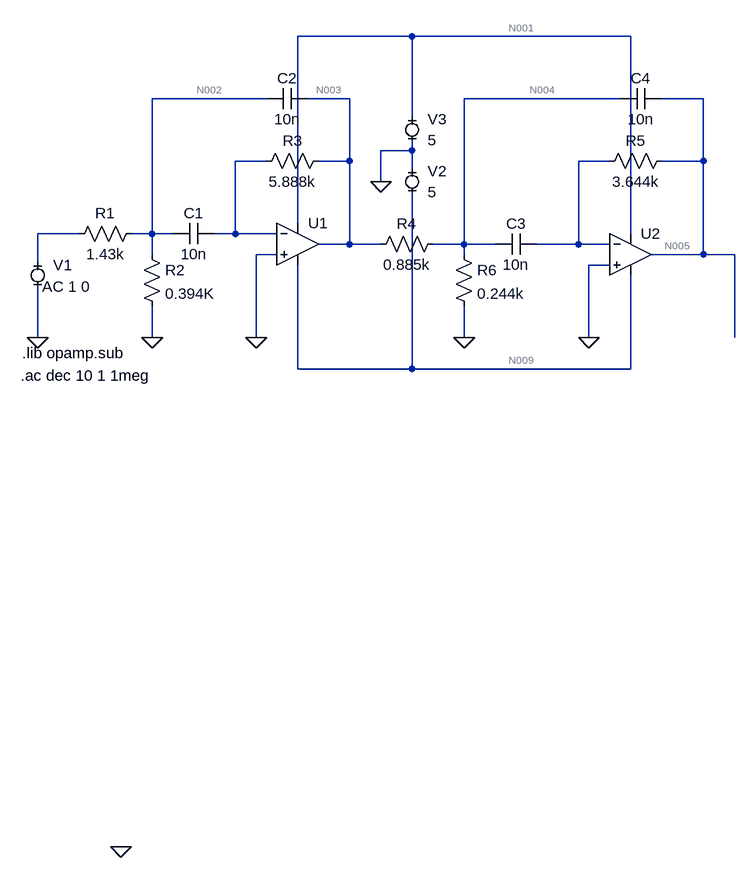
[diagram p0: schematic Draft6.asc]
Draft6.asc, the LTspice schematic file:
Version 4
SHEET 1 964 680
WIRE 448 -1248 272 -1248
WIRE 784 -1248 448 -1248
WIRE 224 -1152 48 -1152
WIRE 352 -1152 288 -1152
WIRE 768 -1152 528 -1152
WIRE 896 -1152 832 -1152
WIRE 448 -1120 448 -1248
WIRE 448 -1072 448 -1088
WIRE 448 -1072 400 -1072
WIRE 224 -1056 176 -1056
WIRE 352 -1056 352 -1152
WIRE 352 -1056 304 -1056
WIRE 752 -1056 704 -1056
WIRE 896 -1056 896 -1152
WIRE 896 -1056 832 -1056
WIRE 448 -1040 448 -1072
WIRE 400 -1024 400 -1072
WIRE 272 -960 272 -1248
WIRE -64 -944 -128 -944
WIRE 48 -944 48 -1152
WIRE 48 -944 16 -944
WIRE 80 -944 48 -944
WIRE 176 -944 176 -1056
WIRE 176 -944 144 -944
WIRE 240 -944 176 -944
WIRE 784 -944 784 -1248
WIRE 352 -928 352 -1056
WIRE 352 -928 304 -928
WIRE 400 -928 352 -928
WIRE 528 -928 528 -1152
WIRE 528 -928 480 -928
WIRE 576 -928 528 -928
WIRE 704 -928 704 -1056
WIRE 704 -928 640 -928
WIRE 752 -928 704 -928
WIRE 48 -912 48 -944
WIRE 240 -912 208 -912
WIRE 528 -912 528 -928
WIRE 896 -912 896 -1056
WIRE 896 -912 816 -912
WIRE 944 -912 896 -912
WIRE -128 -896 -128 -944
WIRE 752 -896 720 -896
WIRE -128 -784 -128 -864
WIRE 48 -784 48 -832
WIRE 208 -784 208 -912
WIRE 528 -784 528 -832
WIRE 720 -784 720 -896
WIRE 944 -784 944 -912
WIRE 272 -736 272 -896
WIRE 448 -736 448 -1008
WIRE 448 -736 272 -736
WIRE 784 -736 784 -880
WIRE 784 -736 448 -736
FLAG 528 -784 0
FLAG 720 -784 0
FLAG 208 -784 0
FLAG 48 -784 0
FLAG -128 -784 0
FLAG 400 -1024 0
FLAG 0 0 0
SYMBOL res 32 -960 R90
WINDOW 0 0 56 VBottom 2
WINDOW 3 32 56 VTop 2
SYMATTR InstName R1
SYMATTR Value 1.43k
SYMBOL res 32 -928 R0
SYMATTR InstName R2
SYMATTR Value 0.394K
SYMBOL cap 144 -960 R90
WINDOW 0 0 32 VBottom 2
WINDOW 3 32 32 VTop 2
SYMATTR InstName C1
SYMATTR Value 10n
SYMBOL res 320 -1072 R90
WINDOW 0 0 56 VBottom 2
WINDOW 3 32 56 VTop 2
SYMATTR InstName R3
SYMATTR Value 5.888k
SYMBOL cap 288 -1168 R90
WINDOW 0 0 32 VBottom 2
WINDOW 3 32 32 VTop 2
SYMATTR InstName C2
SYMATTR Value 10n
SYMBOL res 496 -944 R90
WINDOW 0 0 56 VBottom 2
WINDOW 3 32 56 VTop 2
SYMATTR InstName R4
SYMATTR Value 0.885k
SYMBOL Opamps\\UniversalOpamp2 272 -928 R0
SYMATTR InstName U1
SYMBOL cap 640 -944 R90
WINDOW 0 0 32 VBottom 2
WINDOW 3 32 32 VTop 2
SYMATTR InstName C3
SYMATTR Value 10n
SYMBOL Opamps\\UniversalOpamp2 784 -912 R0
SYMATTR InstName U2
SYMBOL res 848 -1072 R90
WINDOW 0 0 56 VBottom 2
WINDOW 3 32 56 VTop 2
SYMATTR InstName R5
SYMATTR Value 3.644k
SYMBOL cap 832 -1168 R90
WINDOW 0 0 32 VBottom 2
WINDOW 3 32 32 VTop 2
SYMATTR InstName C4
SYMATTR Value 10n
SYMBOL res 512 -928 R0
SYMATTR InstName R6
SYMATTR Value 0.244k
SYMBOL MiniSyms4\\voltage- -128 -880 R0
WINDOW 123 7 17 Left 2
WINDOW 39 0 0 Left 2
SYMATTR InstName V1
SYMATTR Value ""
SYMATTR Value2 AC 1 0
SYMBOL MiniSyms4\\voltage- 448 -1024 R0
SYMATTR InstName V2
SYMATTR Value 5
SYMBOL MiniSyms4\\voltage- 448 -1104 R0
SYMATTR InstName V3
SYMATTR Value 5
TEXT -152 -760 Left 2 !.lib opamp.sub
TEXT -154 -726 Left 2 !.ac dec 10 1 1meg

The netlist it stands for:
* Draft6.asc
R1 N002 N008 1.43k
R2 N002 0 0.394K
C1 N006 N002 10n
R3 N003 N006 5.888k
C2 N003 N002 10n
R4 N004 N003 0.885k
XU1 0 N006 N001 N009 N003 level.2 Avol=1Meg GBW=10Meg Slew=10Meg ilimit=25m rail=0 Vos=0 phimargin=45 en=0 enk=0 in=0 ink=0 Rin=500Meg  ; pins IN+ IN- V+ V- OUT
C3 N007 N004 10n
XU2 0 N007 N001 N009 N005 level.2 Avol=1Meg GBW=10Meg Slew=10Meg ilimit=25m rail=0 Vos=0 phimargin=45 en=0 enk=0 in=0 ink=0 Rin=500Meg  ; pins IN+ IN- V+ V- OUT
R5 N005 N007 3.644k
C4 N005 N004 10n
R6 N004 0 0.244k
V1 N008 0 AC 1 0
V2 0 N009 5
V3 N001 0 5
.lib opamp.sub
.ac dec 10 1 1meg
.lib UniversalOpamps2.sub
.backanno
.end

* Results of the author's LTspice run, read from the files saved beside the schematic
* Operating Point, zero values left out:
*   V(n001) = 5 V
*   V(n009) = -5 V
*   I(V3) = -999.9 µA
*   I(V2) = -999.9 µA
*   Ix(u1:3) = 500 µA
*   Ix(u1:4) = -500 µA
*   Ix(u2:3) = 500 µA
*   Ix(u2:4) = -500 µA
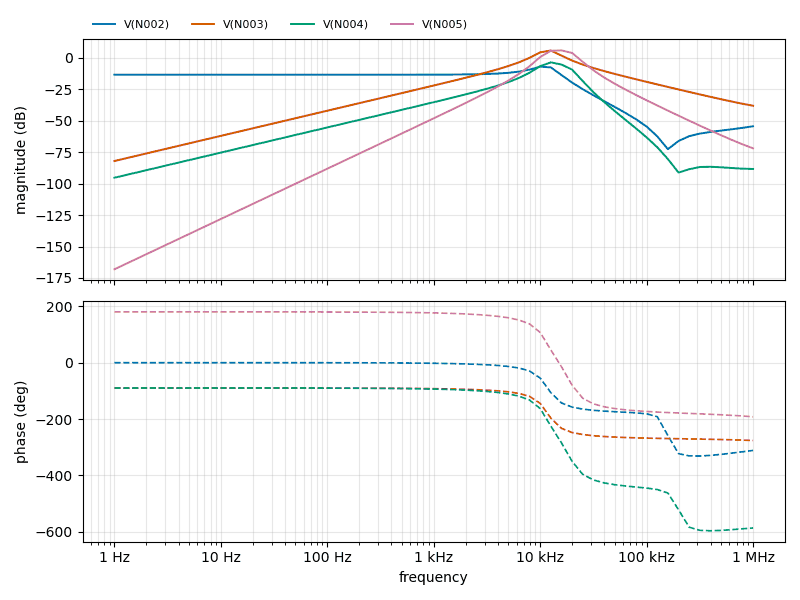
[diagram p1: AC Analysis of Draft6.asc, plotted from the saved traces]
* AC Analysis, 1 run:
*   V(N002): -13.31 dB at 1 Hz, -54.31 dB at 1 MHz, peak -6.92 dB at 10 kHz, 3 dB below the peak at 7.212 kHz and 13.81 kHz
*   V(N003): -81.95 dB at 1 Hz, -38.01 dB at 1 MHz, peak 5.91 dB at 12.59 kHz, 3 dB below the peak at 9.202 kHz and 14.95 kHz
*   V(N004): -95.25 dB at 1 Hz, -88.29 dB at 1 MHz, peak -3.50 dB at 12.59 kHz, 3 dB below the peak at 9.988 kHz and 17.06 kHz
*   V(N005): -168.06 dB at 1 Hz, -71.87 dB at 1 MHz, peak 6.03 dB at 15.85 kHz, 3 dB below the peak at 11.11 kHz and 20.59 kHz